# EAGLE schematic POWER_ROUTE_TEST (EAGLE 6.4)
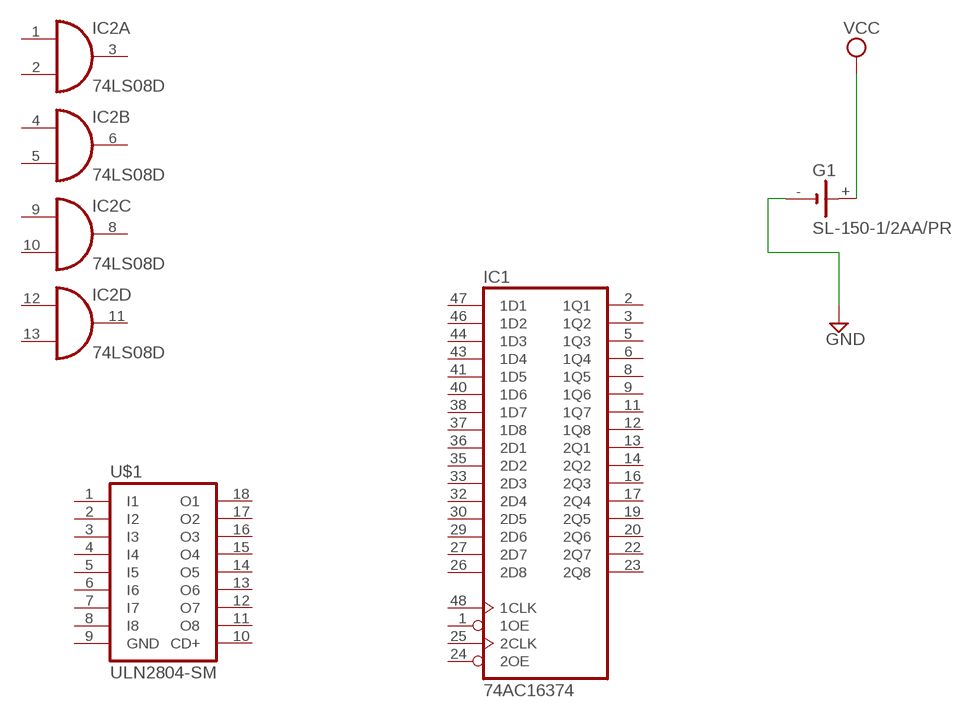
[diagram p0: schematic, sheet 1]

## Parts
G1  SL-150-1/2AA/PR  [SL-150-1/2AA/PR]
IC1  74AC16374  [SSOP48DL]
IC2  74LS08D  [SO14]
U$1  ULN2804-SM  [SOP-18]

## Nets
GND: G1.-
VCC: G1.+
Unconnected: IC1.1(1OE) IC1.2(1Q1) IC1.3(1Q2) IC1.5(1Q3) IC1.6(1Q4) IC1.8(1Q5) IC1.9(1Q6) IC1.11(1Q7) IC1.12(1Q8) IC1.13(2Q1) IC1.14(2Q2) IC1.16(2Q3) IC1.17(2Q4) IC1.19(2Q5) IC1.20(2Q6) IC1.22(2Q7) IC1.23(2Q8) IC1.24(2OE) IC1.25(2CLK) IC1.26(2D8) IC1.27(2D7) IC1.29(2D6) IC1.30(2D5) IC1.32(2D4) IC1.33(2D3) IC1.35(2D2) IC1.36(2D1) IC1.37(1D8) IC1.38(1D7) IC1.40(1D6) IC1.41(1D5) IC1.43(1D4) IC1.44(1D3) IC1.46(1D2) IC1.47(1D1) IC1.48(1CLK) IC2.1(A:I0) IC2.2(A:I1) IC2.3(A:O) IC2.4(B:I0) IC2.5(B:I1) IC2.6(B:O) IC2.8(C:O) IC2.9(C:I0) IC2.10(C:I1) IC2.11(D:O) IC2.12(D:I0) IC2.13(D:I1) U$1.1(I1) U$1.2(I2) U$1.3(I3) U$1.4(I4) U$1.5(I5) U$1.6(I6) U$1.7(I7) U$1.8(I8) U$1.10(CD+) U$1.11(O8) U$1.12(O7) U$1.13(O6) U$1.14(O5) U$1.15(O4) U$1.16(O3) U$1.17(O2) U$1.18(O1)

## Power pins joined to a net without a drawn wire
GND: IC1.4(GND) IC1.10(GND) IC1.15(GND) IC1.21(GND) IC1.28(GND) IC1.34(GND) IC1.39(GND) IC1.45(GND) IC2.7(P:GND) U$1.9(GND)
VCC: IC1.7(VCC) IC1.18(VCC) IC1.31(VCC) IC1.42(VCC) IC2.14(P:VCC)

## Library data of the parts
G1 = battery:SL-150-1/2AA/PR: LI BATTERY Sonnenschein
IC1 = 74ac-logic:74AC16374: 16-bit edge-triggered D-type FLIP FLOP, 3-state
IC2 = 74xx-eu:74*08: Quad 2-input AND gate
U$1 = fairchild-semic:ULN2804-SM: ULN2804 is a high voltage, high current Darlington array comprised of eight NPN Darlington pairs. The device features open-collector outputs with suppression diodes for inductive loads and is ideally suited for interfacing between low-level logic circuitry and high power loads.